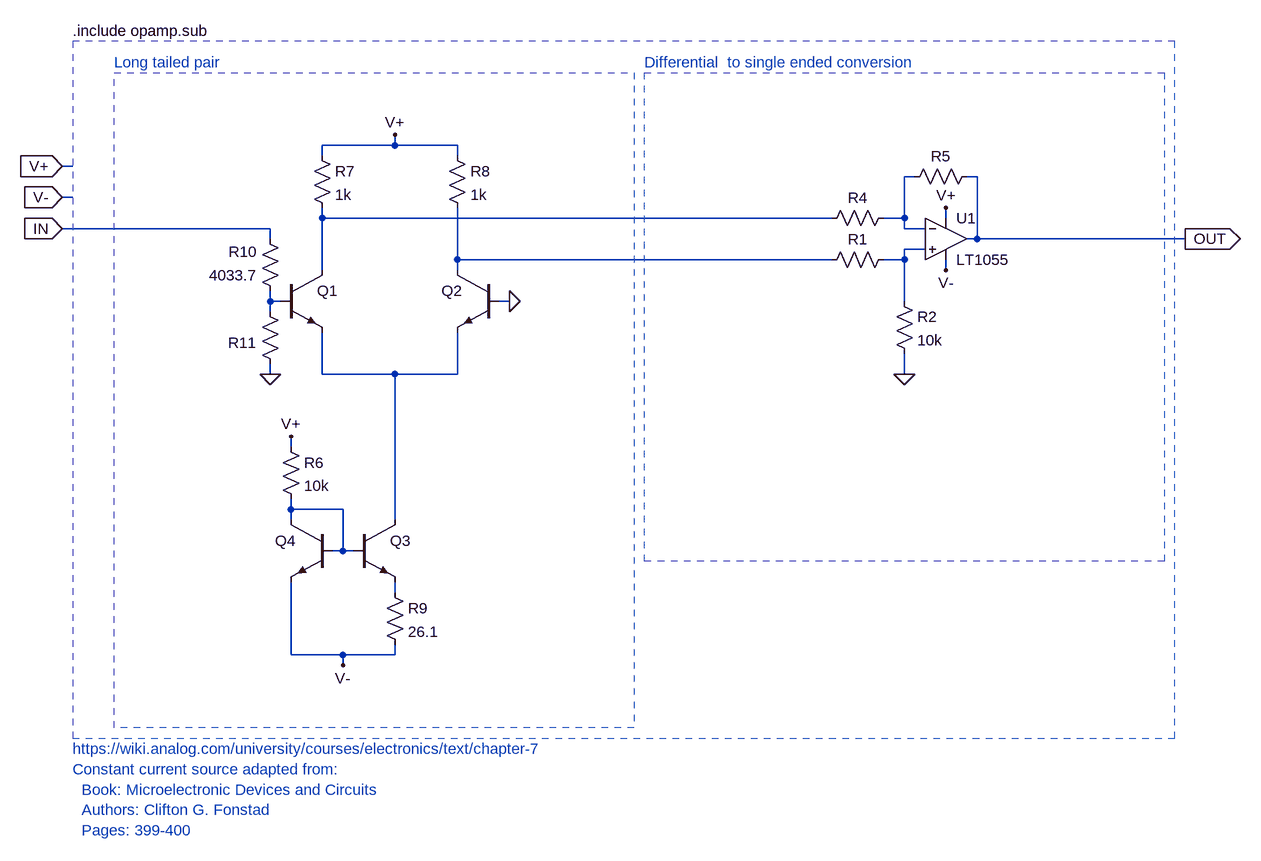
[diagram p0: schematic tanh.asc]
tanh.asc, the LTspice schematic file:
Version 4
SHEET 1 3332 1252
WIRE 1840 192 1840 176
WIRE 1840 192 1728 192
WIRE 1936 192 1840 192
WIRE 1728 208 1728 192
WIRE 1936 208 1936 192
WIRE 1344 224 1328 224
WIRE 2640 240 2624 240
WIRE 2736 240 2720 240
WIRE 1344 272 1328 272
WIRE 1728 304 1728 288
WIRE 2512 304 1728 304
WIRE 2624 304 2624 240
WIRE 2624 304 2592 304
WIRE 2688 304 2688 288
WIRE 1648 320 1328 320
WIRE 2624 320 2624 304
WIRE 2656 320 2624 320
WIRE 1648 336 1648 320
WIRE 2736 336 2736 240
WIRE 2736 336 2720 336
WIRE 3056 336 2736 336
WIRE 2656 352 2624 352
WIRE 1936 368 1936 288
WIRE 2512 368 1936 368
WIRE 2624 368 2624 352
WIRE 2624 368 2592 368
WIRE 1728 384 1728 304
WIRE 1936 384 1936 368
WIRE 2688 384 2688 368
WIRE 1648 432 1648 416
WIRE 1664 432 1648 432
WIRE 2016 432 2000 432
WIRE 2624 432 2624 368
WIRE 1648 448 1648 432
WIRE 1648 544 1648 528
WIRE 1728 544 1728 480
WIRE 1840 544 1728 544
WIRE 1936 544 1936 480
WIRE 1936 544 1840 544
WIRE 2624 544 2624 512
WIRE 1680 656 1680 640
WIRE 1680 752 1680 736
WIRE 1760 752 1680 752
WIRE 1680 768 1680 752
WIRE 1840 768 1840 544
WIRE 1760 816 1760 752
WIRE 1760 816 1744 816
WIRE 1776 816 1760 816
WIRE 1840 880 1840 864
WIRE 1680 976 1680 864
WIRE 1760 976 1680 976
WIRE 1840 976 1840 960
WIRE 1840 976 1760 976
WIRE 1760 992 1760 976
FLAG 2688 288 V+
FLAG 2688 384 V-
FLAG 2016 432 0
FLAG 1840 176 V+
FLAG 1648 544 0
FLAG 2624 544 0
FLAG 1760 992 V-
FLAG 1328 320 IN
IOPIN 1328 320 In
FLAG 3056 336 OUT
IOPIN 3056 336 Out
FLAG 1328 224 V+
IOPIN 1328 224 In
FLAG 1328 272 V-
IOPIN 1328 272 In
FLAG 1680 640 V+
SYMBOL res 2496 320 R270
WINDOW 0 32 56 VTop 2
WINDOW 3 0 56 Invisible 2
SYMATTR InstName R4
SYMATTR Value 10k
SYMBOL res 2736 224 R90
WINDOW 0 0 56 VBottom 2
WINDOW 3 32 56 Invisible 2
SYMATTR InstName R5
SYMATTR Value 10k
SYMBOL Opamps\\LT1055 2688 272 R0
SYMATTR InstName U1
SYMBOL npn 1664 384 R0
WINDOW 3 56 68 Invisible 2
SYMATTR Value 2N2222
SYMATTR InstName Q1
SYMBOL npn 2000 384 M0
WINDOW 3 56 68 Invisible 2
SYMATTR Value 2N2222
SYMATTR InstName Q2
SYMBOL res 1712 192 R0
SYMATTR InstName R7
SYMATTR Value 1k
SYMBOL res 1920 192 R0
SYMATTR InstName R8
SYMATTR Value 1k
SYMBOL res 1664 432 R180
WINDOW 0 36 76 Left 2
WINDOW 3 36 40 Left 2
SYMATTR InstName R10
SYMATTR Value 4033.7
SYMBOL res 1664 544 R180
WINDOW 0 37 48 Left 2
WINDOW 3 36 40 Invisible 2
SYMATTR InstName R11
SYMATTR Value 220
SYMBOL res 2496 384 R270
WINDOW 0 32 56 VTop 2
WINDOW 3 0 56 Invisible 2
SYMATTR InstName R1
SYMATTR Value 10k
SYMBOL res 2608 416 R0
SYMATTR InstName R2
SYMATTR Value 10k
SYMBOL npn 1776 768 R0
WINDOW 3 56 68 Invisible 2
SYMATTR Value 2N2222
SYMATTR InstName Q3
SYMBOL npn 1744 768 M0
WINDOW 3 56 68 Invisible 2
SYMATTR Value 2N2222
SYMATTR InstName Q4
SYMBOL res 1664 640 R0
SYMATTR InstName R6
SYMATTR Value 10k
SYMBOL res 1824 864 R0
SYMATTR InstName R9
SYMATTR Value 26.1
TEXT 1344 16 Left 2 !.include opamp.sub
TEXT 1344 1120 Left 2 ;https://wiki.analog.com/university/courses/electronics/text/chapter-7
TEXT 1408 64 Left 2 ;Long tailed pair
TEXT 2224 64 Left 2 ;Differential  to single ended conversion
TEXT 1344 1152 Left 2 ;Constant current source adapted from:\n  Book: Microelectronic Devices and Circuits\n  Authors: Clifton G. Fonstad\n  Pages: 399-400
RECTANGLE Normal 2208 1088 1408 80 2
RECTANGLE Normal 3024 832 2224 80 2
RECTANGLE Normal 3040 32 1344 1104 2

The netlist it stands for:
* tanh.asc
R4 N002 N001 10k
R5 OUT N001 10k
XU1 N003 N001 V+ V- OUT LT1055  ; pins In+ In- V+ V- OUT
Q1 N002 N005 N006 0 2N2222
Q2 N004 0 N006 0 2N2222
R7 V+ N002 1k
R8 V+ N004 1k
R10 N005 IN 4033.7
R11 0 N005 220
R1 N004 N003 10k
R2 N003 0 10k
Q3 N006 N007 N008 0 2N2222
Q4 N007 N007 V- 0 2N2222
R6 V+ N007 10k
R9 N008 V- 26.1
.model NPN NPN
.model PNP PNP
.lib standard.bjt
.include opamp.sub
* https://wiki.analog.com/university/courses/electronics/text/chapter-7
* Long tailed pair
* Differential  to single ended conversion
* Constant current source adapted from:
*   Book: Microelectronic Devices and Circuits
*   Authors: Clifton G. Fonstad
*   Pages: 399-400
.backanno
.end